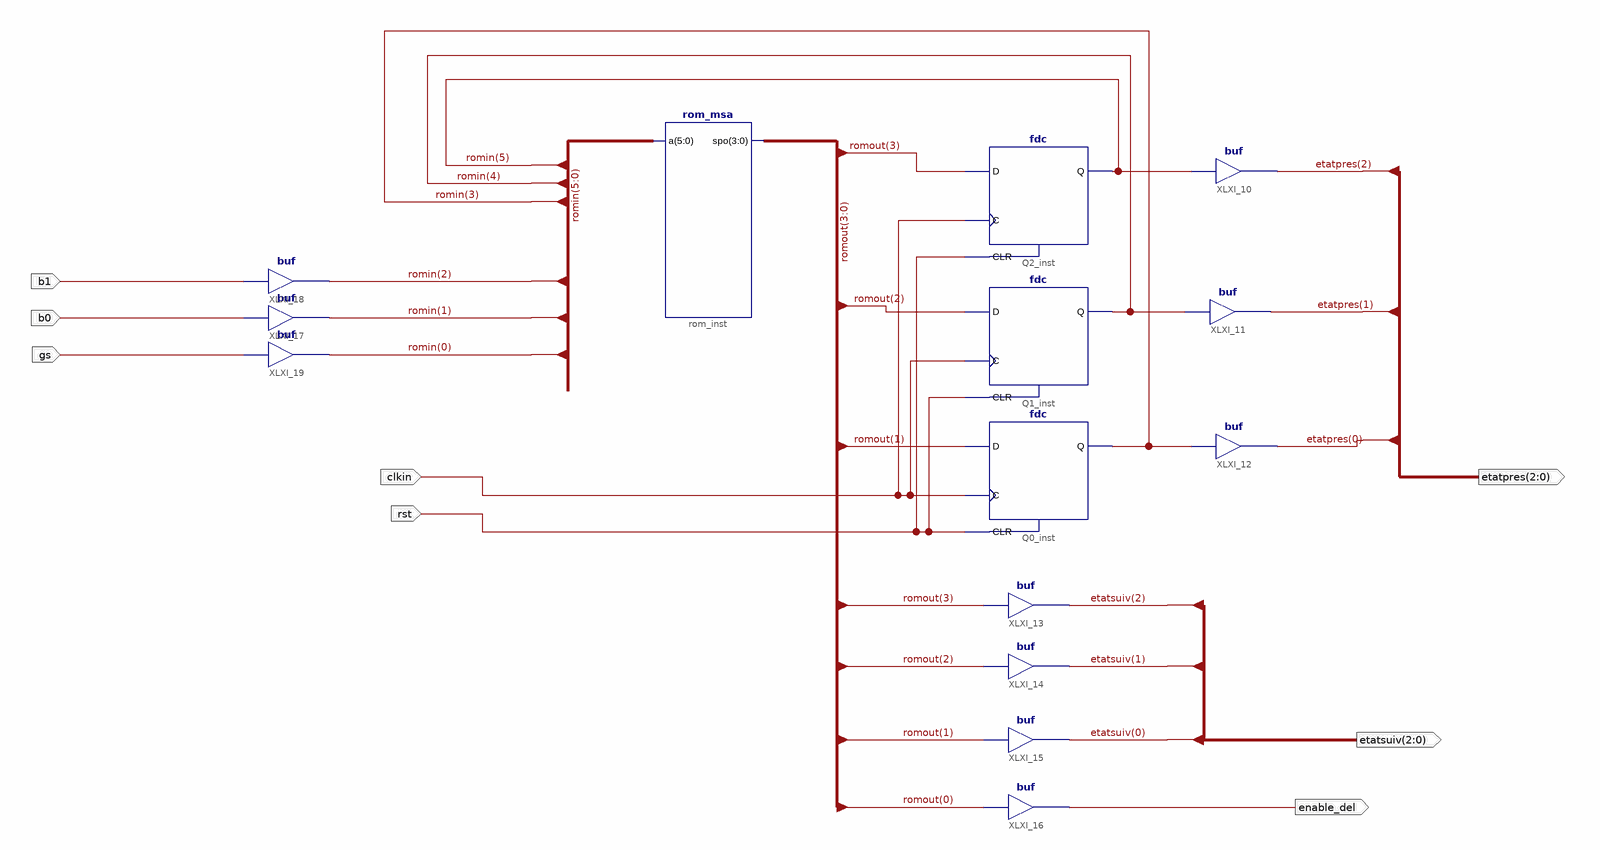
[diagram p0: schematic sheet 1]
// Xilinx ISE schematic msa_sc.sch (spartan6) as structural Verilog: 14 symbols, 8 ports
module msa_sc (
  input  b0,
  input  b1,
  input  gs,
  input  clkin,
  input  rst,
  output [2:0] etatpres,
  output [2:0] etatsuiv,
  output enable_del
);

  wire [3:0] romout;
  wire [5:0] romin;

  rom_msa rom_inst (.a(romin), .spo(romout));
  fdc Q1_inst (.C(clkin), .CLR(rst), .D(romout[2]), .Q(romin[4]));
  fdc Q2_inst (.C(clkin), .CLR(rst), .D(romout[3]), .Q(romin[5]));
  fdc Q0_inst (.C(clkin), .CLR(rst), .D(romout[1]), .Q(romin[3]));
  buf XLXI_10 (etatpres[2], romin[5]);
  buf XLXI_11 (etatpres[1], romin[4]);
  buf XLXI_12 (etatpres[0], romin[3]);
  buf XLXI_13 (etatsuiv[2], romout[3]);
  buf XLXI_14 (etatsuiv[1], romout[2]);
  buf XLXI_15 (etatsuiv[0], romout[1]);
  buf XLXI_16 (enable_del, romout[0]);
  buf XLXI_17 (romin[1], b0);
  buf XLXI_18 (romin[2], b1);
  buf XLXI_19 (romin[0], gs);
endmodule
